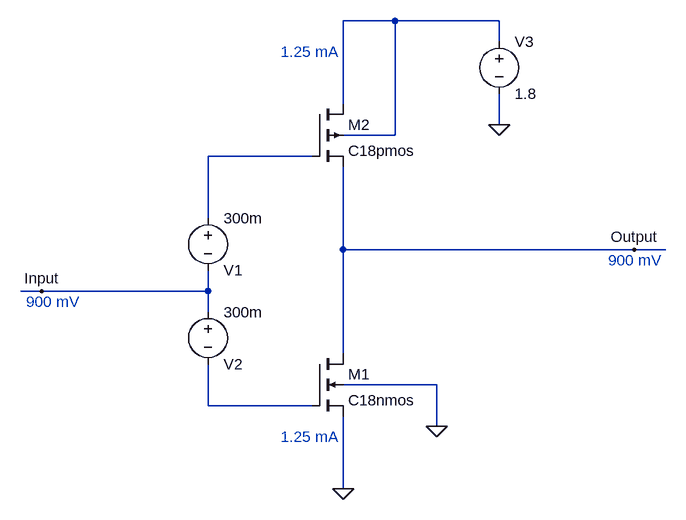
[diagram p0: schematic OutputStageBiased2.asc]
OutputStageBiased2.asc, the LTspice schematic file:
Version 4
SHEET 1 880 680
WIRE 288 -320 208 -320
WIRE 448 -320 288 -320
WIRE 448 -288 448 -320
WIRE 208 -192 208 -320
WIRE 448 -160 448 -208
WIRE 288 -144 288 -320
WIRE 288 -144 208 -144
WIRE 160 -112 0 -112
WIRE 0 -16 0 -112
WIRE 208 32 208 -96
WIRE 656 32 208 32
WIRE 704 32 656 32
WIRE -256 96 -288 96
WIRE 0 96 0 64
WIRE 0 96 -256 96
WIRE 0 128 0 96
WIRE 208 192 208 32
WIRE 352 240 208 240
WIRE 0 272 0 208
WIRE 160 272 0 272
WIRE 352 304 352 240
WIRE 208 400 208 288
FLAG 208 400 0
FLAG 448 -160 0
FLAG -256 96 Input
FLAG 656 32 Output
FLAG 352 304 0
SYMBOL nmos4 160 192 R0
SYMATTR InstName M1
SYMATTR Value C18nmos
SYMATTR Value2 l={L_N} w={W_N}
SYMBOL pmos4 160 -192 R0
SYMATTR InstName M2
SYMATTR Value C18pmos
SYMATTR Value2 l={L_P} w={W_P}
SYMBOL voltage 0 -32 R0
WINDOW 0 24 96 Left 2
WINDOW 3 24 16 Left 2
WINDOW 123 0 0 Left 0
WINDOW 39 0 0 Left 0
SYMATTR InstName V1
SYMATTR Value 300m
SYMBOL voltage 0 112 R0
WINDOW 0 24 96 Left 2
WINDOW 3 24 16 Left 2
WINDOW 123 0 0 Left 0
WINDOW 39 0 0 Left 0
SYMATTR InstName V2
SYMATTR Value 300m
SYMBOL voltage 448 -304 R0
WINDOW 123 0 0 Left 0
WINDOW 39 0 0 Left 0
SYMATTR InstName V3
SYMATTR Value 1.8
TEXT 616 48 Left 2 ;900 mV
TEXT -280 112 Left 2 ;900 mV
TEXT 112 -272 Left 2 ;1.25 mA
TEXT 112 320 Left 2 ;1.25 mA

The netlist it stands for:
* OutputStageBiased2.asc
M1 Output N003 0 0 C18nmos l={L_N} w={W_N}
M2 N001 N002 Output N001 C18pmos l={L_P} w={W_P}
V1 N002 Input 300m
V2 Input N003 300m
V3 N001 0 1.8
.model NMOS NMOS
.model PMOS PMOS
.lib standard.mos
* 900 mV
* 900 mV
* 1.25 mA
* 1.25 mA
.backanno
.end